# Altium schematic sheet Power.SchDoc
size A4
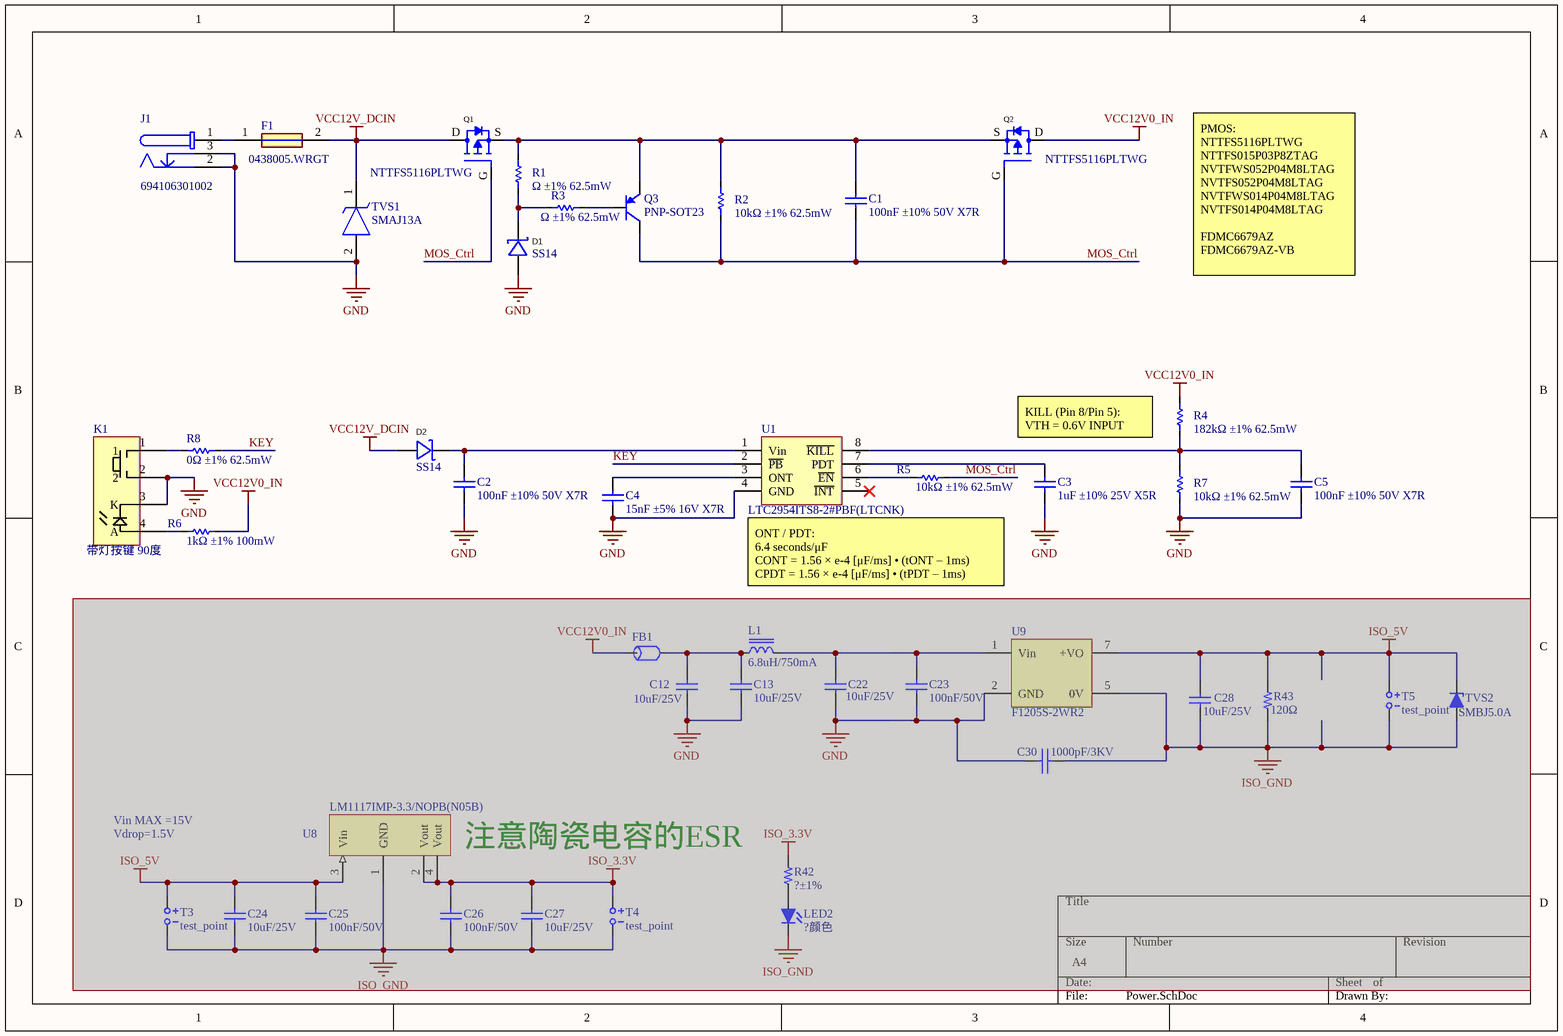
[diagram p0: Power.SchDoc]

## Parts
C1  100nF ±10% 50V X7R  [C0402]
C2  100nF ±10% 50V X7R  [C0402]
C3  1uF ±10% 25V X5R  [C0402]
C4  15nF ±5% 16V X7R  [C0402]
C5  100nF ±10% 50V X7R  [C0402]
C12  10uF/25V  [C-1210]  (masked out: inside a compile mask, not in the netlist)
C13  10uF/25V  [C-1210]  (masked out: inside a compile mask, not in the netlist)
C22  10uF/25V  [C-1210]  (masked out: inside a compile mask, not in the netlist)
C23  100nF/50V  [C-0603]  (masked out: inside a compile mask, not in the netlist)
C24  10uF/25V  [C-1206]  (masked out: inside a compile mask, not in the netlist)
C25  100nF/50V  [C-0603]  (masked out: inside a compile mask, not in the netlist)
C26  100nF/50V  [C-0603]  (masked out: inside a compile mask, not in the netlist)
C27  10uF/25V  [C-1206]  (masked out: inside a compile mask, not in the netlist)
C28  10uF/25V  [C-1210]  (masked out: inside a compile mask, not in the netlist)
C30  1000pF/3KV  [HV_CAP]  (masked out: inside a compile mask, not in the netlist)
D1  SS14  [SOD-123_L2.8-W1.8-LS3.7-RD]
D2  SS14  [SOD-123_L2.8-W1.8-LS3.7-RD]
F1  0438005.WRGT  [FUSC1508X58N]
FB1  贴片磁珠600R@100MHz,2500mA,1206  [FB-1206]  (value not drawn)  (masked out: inside a compile mask, not in the netlist)
J1  694106301002  [694106301002]
K1  带灯按键 90度  [带灯按键 90度]
L1  6.8uH/750mA  [L-WE-TPC Size 3816]  (masked out: inside a compile mask, not in the netlist)
LED2  ?颜色  [LED-0805]  (masked out: inside a compile mask, not in the netlist)
Q1  NTTFS5116PLTWG  [PDFN3333-8_L3.1-W3.2-P0.65-LS3.4-BL]
Q2  NTTFS5116PLTWG  [PDFN3333-8_L3.1-W3.2-P0.65-LS3.4-BL]
Q3  PNP-SOT23  [SOT23-3]
R1  Ω ±1% 62.5mW  [R0402]
R2  10kΩ ±1% 62.5mW  [R0402]
R3  Ω ±1% 62.5mW  [R0402]
R4  182kΩ ±1% 62.5mW  [R0402]
R5  10kΩ ±1% 62.5mW  [R0402]
R6  1kΩ ±1% 100mW  [R0603]
R7  10kΩ ±1% 62.5mW  [R0402]
R8  0Ω ±1% 62.5mW  [R0402]
R42  ?±1%  [R-0603]  (masked out: inside a compile mask, not in the netlist)
R43  120Ω  [R-2512]  (masked out: inside a compile mask, not in the netlist)
T3  test_point  [TP-DIP-2]  (masked out: inside a compile mask, not in the netlist)
T4  test_point  [TP-DIP-2]  (masked out: inside a compile mask, not in the netlist)
T5  test_point  [TP-DIP-2]  (masked out: inside a compile mask, not in the netlist)
TVS1  SMAJ13A  [DIONM5126X250N]
TVS2  SMBJ5.0A  [DO-214AA/SMB]  (masked out: inside a compile mask, not in the netlist)
U1  LTC2954ITS8-2#PBF(LTCNK)  [SOT23-8]
U8  LM1117IMP-3.3/NOPB(N05B)  [SOT223]  (masked out: inside a compile mask, not in the netlist)
U9  F1205S-2WR2  [F_S-2WR2]  (masked out: inside a compile mask, not in the netlist)

## Nets
GND: C2.1 C3.1 C4.1 C5.1 D1.2(A) J1.2 J1.3 K1.2 K1.3(K) R7.1 TVS1.2(A) U1.4(GND)
VCC12V0_IN: Q2.D R4.2 R6.2
VCC12V_DCIN: D2.2(A) F1.2 Q1.D TVS1.1(K)
KEY: R8.2 U1.2(~{PB})
MOS_Ctrl: C1.1 Q1.G Q2.G Q3.3(C) R2.1 R5.2
NetC1_2: C1.2 Q1.S Q2.S Q3.2(E) R1.1 R2.2
NetC2_2: C2.2 D2.1(K) U1.1(Vin)
NetC3_2: C3.2 U1.7(PDT)
NetC4_2: C4.2 U1.3(ONT)
NetC5_2: C5.2 R4.1 R7.2 U1.8(~{KILL})
NetD1_1: D1.1(K) R1.2 R3.2
NetF1_1: F1.1 J1.1
NetK1_1: K1.1 R8.1
NetK1_4: K1.4(A) R6.1
NetQ3_1: Q3.1(B) R3.1
NetR5_1: R5.1 U1.6(~{EN})

Not connected (* = marked no-connect by the designer): U1 5(~{INT})*

## Notes on the sheet
- PMOS:
  NTTFS5116PLTWG
  NTTFS015P03P8ZTAG
  NVTFWS052P04M8LTAG
  NVTFS052P04M8LTAG
  NVTFWS014P04M8LTAG
  NVTFS014P04M8LTAG
  FDMC6679AZ
  FDMC6679AZ-VB
- KILL (Pin 8/Pin 5):
  VTH = 0.6V INPUT
- ONT / PDT:
  6.4 seconds/μF
  CONT = 1.56 × e-4 [μF/ms] • (tONT – 1ms)
  CPDT = 1.56 × e-4 [μF/ms] • (tPDT – 1ms)
- Vin MAX =15V
- Vdrop=1.5V
- (near U8) 注意陶瓷电容的ESR

## Library data of the parts
C1 C2 = C0402: CL05B104KB54PNC; Published: 8-Jun-2000; LatestRevisionDate: 17-Jul-2002; LatestRevisionNote: Re-released for DXP Platform.; PackageReference: RAD-0.3; Publisher: Altium Limited; PackageDescription: Radial Cap, Thru-Hole; 2 Leads; 0.3 in Pin Spacing
C3 = C0402: CL05A105KA5NQNC; Published: 8-Jun-2000; LatestRevisionDate: 17-Jul-2002; LatestRevisionNote: Re-released for DXP Platform.; PackageReference: RAD-0.3; Publisher: Altium Limited; PackageDescription: Radial Cap, Thru-Hole; 2 Leads; 0.3 in Pin Spacing
C4 = C0402: CC0402JRX7R7BB153; Published: 8-Jun-2000; LatestRevisionDate: 17-Jul-2002; LatestRevisionNote: Re-released for DXP Platform.; PackageReference: RAD-0.3; Publisher: Altium Limited; PackageDescription: Radial Cap, Thru-Hole; 2 Leads; 0.3 in Pin Spacing
C5 = C0402: NC; Published: 8-Jun-2000; LatestRevisionDate: 17-Jul-2002; LatestRevisionNote: Re-released for DXP Platform.; PackageReference: RAD-0.3; Publisher: Altium Limited; PackageDescription: Radial Cap, Thru-Hole; 2 Leads; 0.3 in Pin Spacing
C12 C13 C22 C28 = C-1210
C23 C25 C26 = C-0603: 物料编号: *; 物料名称: *; 厂家: *; 详细描述: *
C24 C27 = C-1206
C30 = CAP: 品牌：VISHAY(威世)，型号：S102K43X7RR6###R , 径向引线, X7R，ROHS
D1 = Diode_Schottky: NC; Manufacturer: DIODES(美台); Name: B340A-13-F; Add into BOM: yes; Reverse Voltage (Vr): 40V; Average Rectified Current (Io): 3A; Forward Voltage (Vf@If): 500mV@3A; Symbol: B340A-13-F; Device: B340A-13-F; LCSC Part Name: 40V 3A 500mV@3A; Supplier Part: C85098; Manufacturer Part: B340A-13-F; Supplier Footprint: SMA(DO-214AC); JLCPCB Part Class: 扩展库; Datasheet: https://atta.szlcsc.com/upload/public/pdf/source/20171023/C134454_15087453575121052549.pdf; Supplier: LCSC; Convert to PCB: yes
D2 = Diode_Schottky: 直流反向耐压(Vr):40V;平均整流电流(Io):3A;正向压降(Vf):500mV@3A;; Manufacturer: DIODES(美台); Name: B340A-13-F; Add into BOM: yes; Reverse Voltage (Vr): 40V; Average Rectified Current (Io): 3A; Symbol: B340A-13-F; Device: B340A-13-F; LCSC Part Name: 40V 3A 500mV@3A; Supplier Part: C85098; Manufacturer Part: B340A-13-F; Supplier Footprint: SMA(DO-214AC); JLCPCB Part Class: 扩展库; Datasheet: https://atta.szlcsc.com/upload/public/pdf/source/20171023/C134454_15087453575121052549.pdf; Supplier: LCSC; Convert to PCB: yes; Forward Voltage (Vf@If): 500mV@3A
F1 = 0438005.WRGT: Fuse; Manufacturer_Name: LITTELFUSE; Datasheet Link: https://componentsearchengine.com/Datasheets/1/0438005.WRGT.pdf; Height: 0.582mm; Manufacturer_Part_Number: 0438005.WRGT; Mouser Part Number: 576-0438005.WRGT; Mouser Price/Stock: https://www.mouser.com/Search/Refine.aspx?Keyword=576-0438005.WRGT
FB1 = FB-1206: 品牌:Wurth品牌:Wurth，型号: 742792118, Rdc=0.07ohm，size 1206,2500mA，符合ROHS。
J1 = 694106301002: WR-DC DC Power Jack Connector, Male, Right Angled, 24V, 5A / 694106301002; Manufacturer: Wurth Elektronik; Opening Diameter: 6.4mm; Plug Inner Diameter: 2.05mm; Plug Outer Diameter: 5.5mm; ComponentLink1Description: Website Link; ComponentLink1URL: https://www.we-online.com/redexpert/article/694106301002?ad; ComponentLink2Description: Datasheet Link; ComponentLink2URL: https://www.we-online.com/redexpert/spec/694106301002?ad; Manufacturer Part Number: 694106301002; Category: DC Power Jack Connector; Match Code: WR-DC; Mount: Through Hole; Operating Temperature Max: 85°C; Operating Temperature Min: -40°C; Packaging: Bag; Gender: Male; Orientation: Right Angled; Rated Current: 5A; Working Voltage: 24V
K1 = POWER_BUTTON: TS-H016; Parameter 1: TS-H016电源开关侧面插件带灯按键 带LED带帽轻触开关4脚点动复位; ComponentLink1Description: taobao link; ComponentLink1URL: https://item.taobao.com/item.htm?app=weixin&bc_fl_src=share-1041097531982389-2-1&bxsign=scduCA0xal-XO8IOwCg5wpTZ62_4hWwrR0o31cAdmFM1qwUmTOvBCID45R3aVFF8pt6SUX1bUUi6K5MIUE04984LWsOBYZqPz2LXT-xbCklezIcbpRGb4Vs3nExVJYaKKq1&cpp=1&id=599692982889&share_crt_v=1&shareurl=true&short_name=h.T6a6hoVG2KmpkJn&sp_tk=dGhrRDNBSzdnb0I%3D&spm=a2159r.13376460.0.0&tbSocialPopKey=shareItem&tk=thkD3AK7goB&un=3f7bc5679e1c2122bbeeeafdb2768e28&un_site=0&ut_sk=1.YK5Oo3FhLCsDAFsJTsxT4p%2B9_21646297_1735282890710.TaoPassword-WeiXin.1&wxsign=tbwrY1V3kXLW1TVuXAlXQ7LMXaRBWfNsmYrNdzs_BFf0gVdZDK8ioCyrkJLZUEYuHe7DcYAE18qP4vC7nR0yzLoQIoOnRTZ2JqIke5QBALRu3QiIMuws65MGu8OR8kGGz63&skuId=4186836653152
L1 = L-WE-TPC Size 3816
LED2 = LED-0805
Q1 Q2 = MOSFET-P: Manufacturer: VISHAY(威世); Symbol: SI7463ADP-T1-GE3; Add into BOM: yes; Type: P沟道; Drain Source Voltage (Vdss): 40V; Continuous Drain Current (Id): 46A; Power Dissipation (Pd): 5W；39W; Drain Source On Resistance (RDS(on)@Vgs,Id): 10mΩ@15A,10V; Gate Threshold Voltage (Vgs(th)@Id): 2.3V@250uA; Total Gate Charge (Qg@Vgs): 144nC@10V; Input Capacitance (Ciss@Vds): 4.15nF@20V; Device: SI7463ADP-T1-GE3; Supplier: LCSC; Supplier Part: C469466; Manufacturer Part: SI7463ADP-T1-GE3; JLCPCB Part Class: Extended Part; LCSC Part Name: P沟道 耐压:40V 电流:46A; Supplier Footprint: PowerPAK-SO-8; Datasheet: https://atta.szlcsc.com/upload/public/pdf/source/20201103/C469466_DEB614A703506C939C03FF0A9B0AE822.pdf; Convert to PCB: yes; Reverse Transfer Capacitance (Crss@Vds): -; Operating Temperature: -55℃~+150℃@(Tj)
Q3 = PNP-SOT23: NC
R1 R3 = R0402: NC; Published: 8-Jun-2000; LatestRevisionDate: 17-Jul-2002; LatestRevisionNote: Re-released for DXP Platform.; PackageReference: AXIAL-0.3; Publisher: Altium Limited; PackageDescription: Axial Device, Thru-Hole; 2 Leads; 0.3 in Pin Spacing
R2 R5 R7 = R0402: 0402WGF1002TCE; Published: 8-Jun-2000; LatestRevisionDate: 17-Jul-2002; LatestRevisionNote: Re-released for DXP Platform.; PackageReference: AXIAL-0.3; Publisher: Altium Limited; PackageDescription: Axial Device, Thru-Hole; 2 Leads; 0.3 in Pin Spacing
R4 = R0402: RC0402FR-07182KL; Published: 8-Jun-2000; LatestRevisionDate: 17-Jul-2002; LatestRevisionNote: Re-released for DXP Platform.; PackageReference: AXIAL-0.3; Publisher: Altium Limited; PackageDescription: Axial Device, Thru-Hole; 2 Leads; 0.3 in Pin Spacing
R6 = R0603: 0603WAF1001T5E; Published: 8-Jun-2000; LatestRevisionDate: 17-Jul-2002; LatestRevisionNote: Re-released for DXP Platform.; PackageReference: AXIAL-0.3; Publisher: Altium Limited; PackageDescription: Axial Device, Thru-Hole; 2 Leads; 0.3 in Pin Spacing
R8 = R0402: 0402WGF0000TCE; Published: 8-Jun-2000; LatestRevisionDate: 17-Jul-2002; LatestRevisionNote: Re-released for DXP Platform.; PackageReference: AXIAL-0.3; Publisher: Altium Limited; PackageDescription: Axial Device, Thru-Hole; 2 Leads; 0.3 in Pin Spacing
R42 = R-0603
R43 = 3Ω_1: 国巨RC2512FK-073R; 物料编号: 210002441; 详细描述: 2512,1W,国巨RC2512FK-073R; 制造商: 国巨; 版本: V1.00; 名称: 贴片电阻3±1%
T3-T5 = TP-DIP-2
TVS1 = SMAJ13A: TVS Diode (Uni-directional); Manufacturer_Name: LITTELFUSE; Datasheet Link: https://componentsearchengine.com/Datasheets/2/SMAJ13A.pdf; Height: 2.5mm; Manufacturer_Part_Number: SMAJ13A; Mouser Part Number: 576-SMAJ13A; Mouser Price/Stock: https://www.mouser.co.uk/ProductDetail/Littelfuse/SMAJ13A?qs=HR2RnyOI4E60xAs7pDj%2F%252BA%3D%3D; Arrow Part Number: SMAJ13A; Arrow Price/Stock: https://www.arrow.com/en/products/smaj13a/littelfuse
TVS2 = TVS-Diode-214AA/SMB
U1 = LTC2954ITS8-2#PBF: Linear,LTC2954ITS8-2#PBF,TSOT-23,–40~+85°C,; 名称: 电源管理芯片LTC2954ITS8-2#PBF; 制造商: Linear
U8 = LM1117IMP-3.3/NOPB: 品牌：TI，型号：LM1117IMP-3.3/NOPB，800-mA Low-Dropout，SOT223，-40~+ 125°C，ROHS
U9 = F_S-2WR2: 品牌：金升阳，型号：，3000VDC隔离，输出2W